# Altium schematic sheet 485.SchDoc
size A4
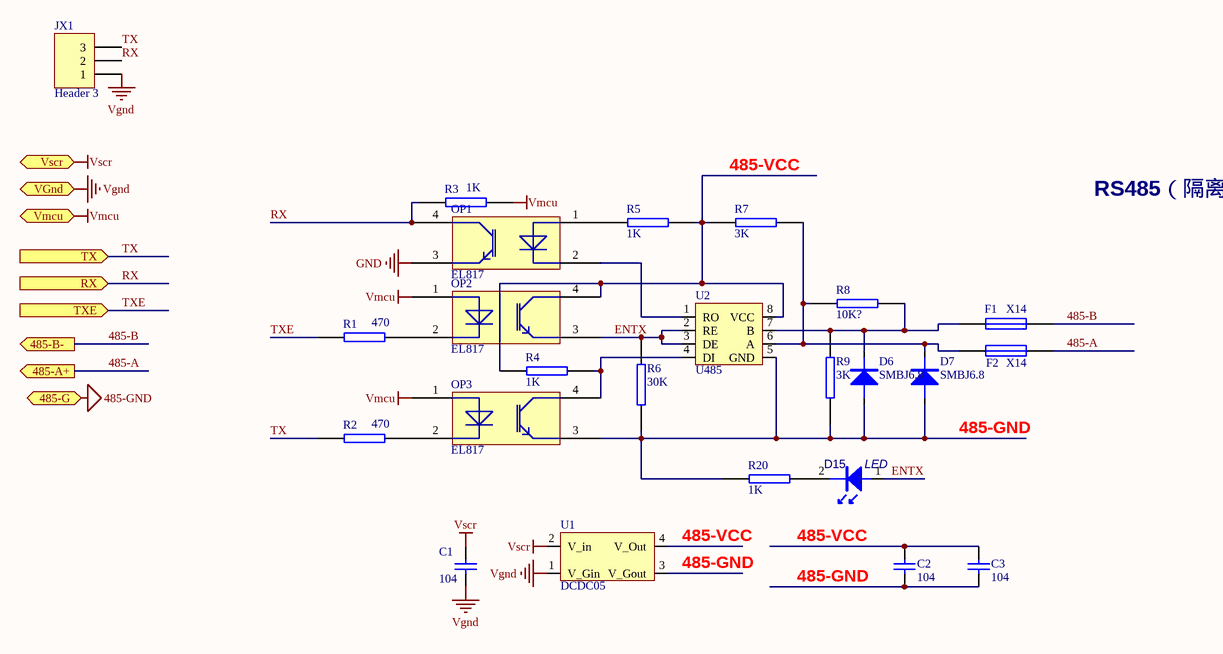
[diagram p0: 485.SchDoc]

## Parts
C1  104  [C0805]
C2  104  [C0805]
C3  104  [C0805]
D6  SMBJ6.8  [SMBJ_SMT]
D7  SMBJ6.8  [SMBJ_SMT]
D15  LED  [LED0805]
F1  X14  [PPTC_SMT]
F2  X14  [PPTC_SMT]
JX1  Header 3  [HDR1X3]
OP1  EL817  [PS2701]
OP2  EL817  [PS2701]
OP3  EL817  [PS2701]
R1  470  [0805R]
R2  470  [0805R]
R3  1K  [0805R]
R4  1K  [0805R]
R5  1K  [0805R]
R6  30K  [0805R]
R7  3K  [0805R]
R8  10K?  [0805R]
R9  3K  [0805R]
R20  1K  [0805R]
U1  DCDC05  [VScore]
U2  U485  [SOP8]

## Ports
485-A+ (out), 485-B- (out), 485-G (out), RX (in), TX (in), TXE (in), VGnd (in), Vmcu (in), Vscr (in)

## Nets
485-GND: C2.1 C3.1 D6.A D7.A OP3.3 R6.1 R9.1 R20.1 U1.3(V_Gout) U2.5(GND) ; port 485-G
GND: OP1.3
Vgnd: C1.1 JX1.1 U1.1(V_Gin) ; port VGnd
Vmcu: OP2.1 OP3.1 R3.1 ; port Vmcu
Vscr: C1.2 U1.2(V_in) ; port Vscr
485-A: F2.1 ; port 485-A+
485-B: F1.1 ; port 485-B-
485-VCC: C2.2 C3.2 OP2.4 R4.1 R5.2 R7.2 U1.4(V_Out) U2.8(VCC)
ENTX: D15.1 OP2.3 R6.2 U2.2(RE) U2.3(DE)
RX: JX1.2 OP1.4 R3.2 ; port RX
TX: JX1.3 R2.2 ; port TX
TXE: R1.2 ; port TXE
NetD6_K: D6.K F1.2 R8.1 R9.2 U2.7(B)
NetD7_K: D7.K F2.2 R7.1 R8.2 U2.6(A)
NetD15_2: D15.2 R20.2
NetOP1_1: OP1.1 R5.1
NetOP1_2: OP1.2 U2.1(RO)
NetOP2_2: OP2.2 R1.1
NetOP3_2: OP3.2 R2.1
NetOP3_4: OP3.4 R4.2 U2.4(DI)

## Notes on the sheet
- RS485（隔离）
- Title
- Size:
- Date:
- File:
- A0
- Number:
- Time:
- Revision:
- Sheet
- of

## Library data of the parts
C1-C3 = Cap: Capacitor; Published: 8-Jun-2000; LatestRevisionDate: 17-Jul-2002; LatestRevisionNote: Re-released for DXP Platform.; PackageReference: RAD-0.3; Publisher: Altium Limited
D6 D7 = DIODE
F1 F2 = Fuse 1: Fuse; Published: 8-Jun-2000; LatestRevisionDate: 17-Jul-2002; LatestRevisionNote: Re-released for DXP Platform.; PackageReference: PIN-W2/E2.8; Publisher: Altium Limited
JX1 = Header 3: Header, 3-Pin; LatestRevisionDate: 17-Jul-2002; LatestRevisionNote: Re-released for DXP Platform.; Publisher: Altium Limited
R1-R9 R20 = RES2
U1 = VScoure